# EAGLE design Mega8 (EAGLE 5.11)
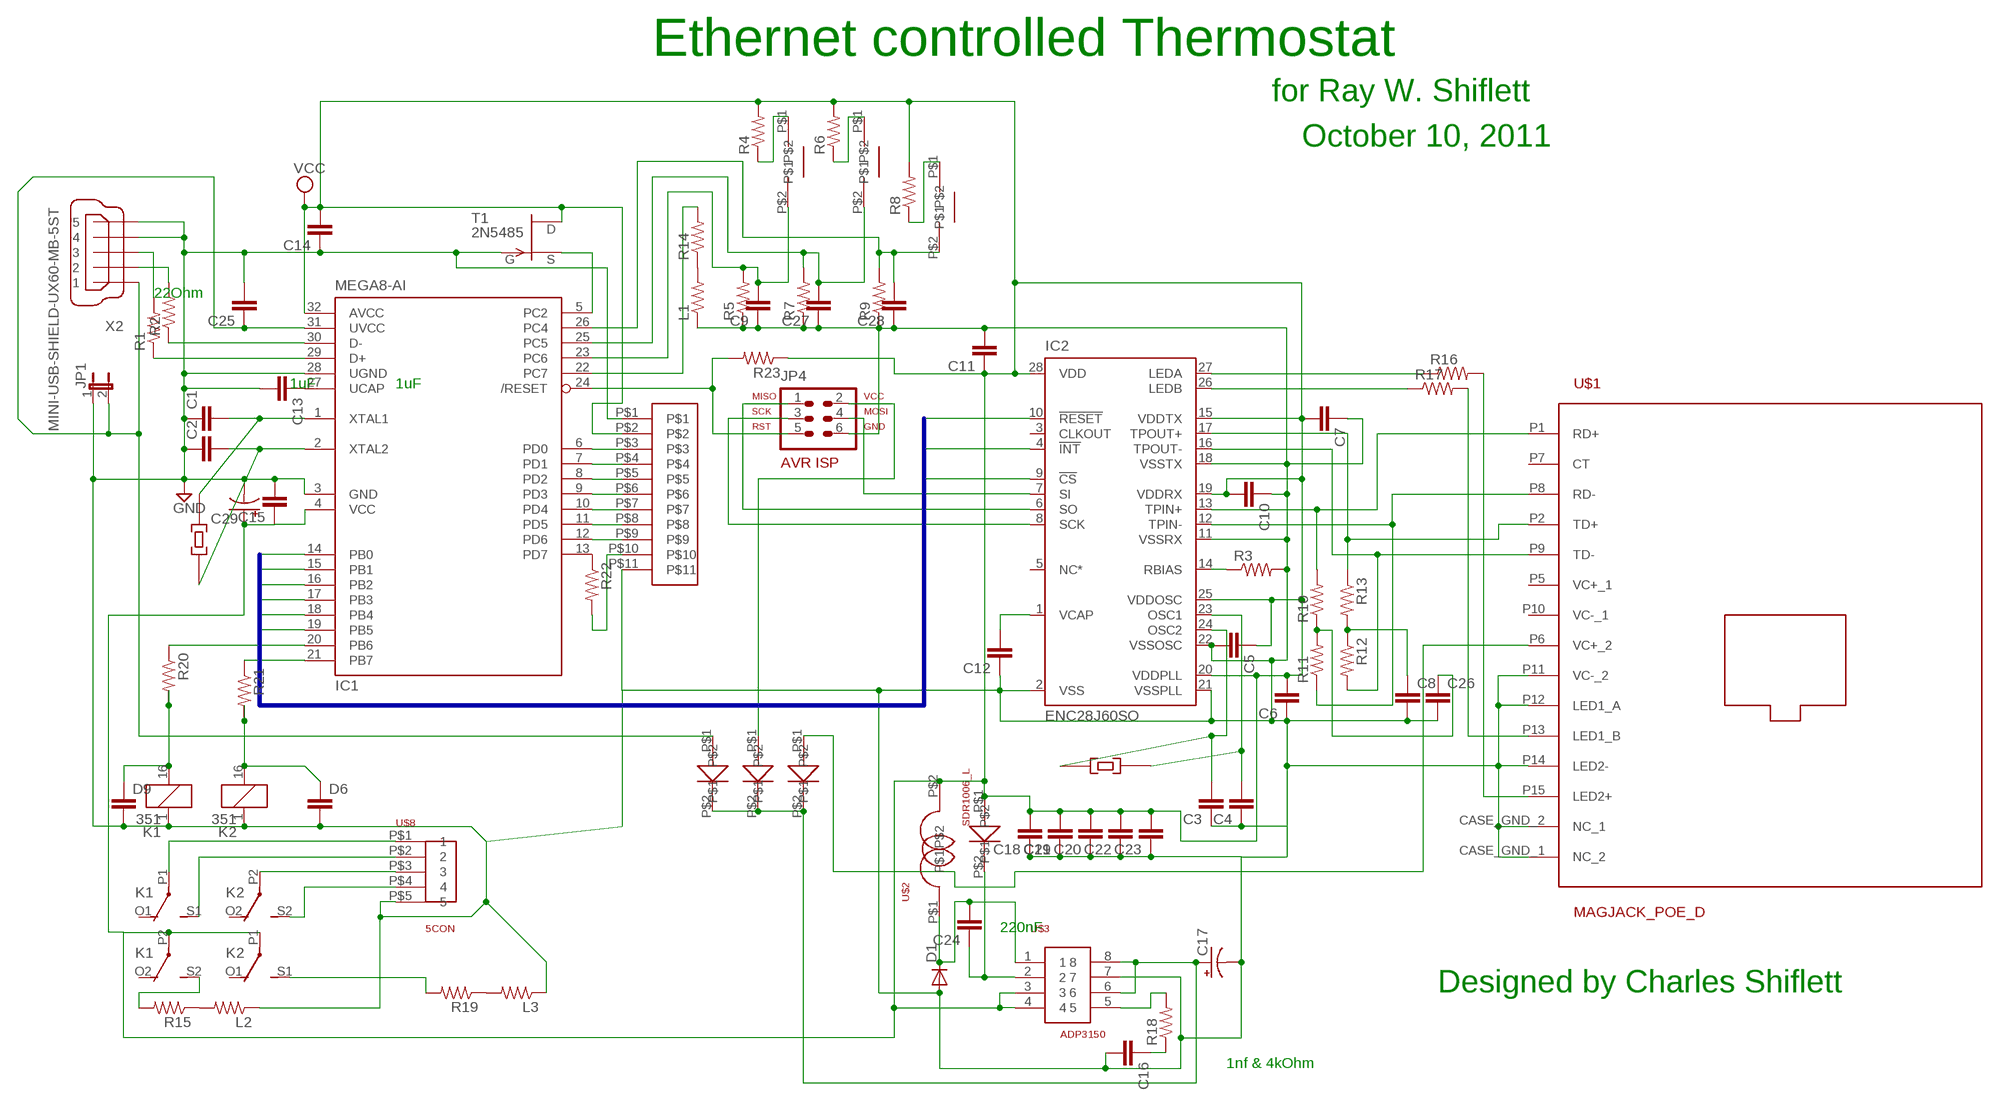
[diagram p0: schematic, sheet 1]

## Parts
C1  C-EUC0805  [C0805]
C2  C-EUC0805  [C0805]
C3  C-EUC0805  [C0805]
C4  C-EUC0805  [C0805]
C5  C-EUC0805  [C0805]
C6  C-EUC0805  [C0805]
C7  C-EUC0805  [C0805]
C8  C-EUC0805  [C0805]
C9  C-EUC0805  [C0805]
C10  C-EUC0805  [C0805]
C11  C-EUC0805  [C0805]
C12  C-EUC0805  [C0805]
C13  C-EUC0805  [C0805]
C14  C-EUC0805  [C0805]
C15  C-EUC0805  [C0805]
C16  C-EUC0805  [C0805]
C17  CPOL-USF  [PANASONIC_F]
C18  C-EUC0805  [C0805]
C19  C-EUC0805  [C0805]
C20  C-EUC0805  [C0805]
C21  C-EUC0805  [C0805]
C22  C-EUC0805  [C0805]
C23  C-EUC0805  [C0805]
C24  C-EUC0805  [C0805]
C25  C-EUC0805  [C0805]
C26  C-EUC0805  [C0805]
C27  C-EUC0805  [C0805]
C28  C-EUC0805  [C0805]
C29  CPOL-USD  [PANASONIC_D]
D1  DIODE-SMB  [SMB]
D6  C-EUC0603  [C0603]
D9  C-EUC0603  [C0603]
IC1  MEGA8-AI  [TQFP32-08]
IC2  ENC28J60SO  [SO28W]
JP1  JP1E  [JP1]
JP4  AVR-ISP-6VERT  [AVR-ISP-6]
K1  351  [351]
K2  351  [351]
L1  R-US_M0805  [M0805]
L2  R-US_M0805  [M0805]
L3  R-US_M0805  [M0805]
R1  R-US_M0805  [M0805]
R2  R-US_M0805  [M0805]
R3  R-US_M0805  [M0805]
R4  R-US_M0805  [M0805]
R5  R-US_M0805  [M0805]
R6  R-US_M0805  [M0805]
R7  R-US_M0805  [M0805]
R8  R-US_M0805  [M0805]
R9  R-US_M0805  [M0805]
R10  R-US_M0805  [M0805]
R11  R-US_M0805  [M0805]
R12  R-US_M0805  [M0805]
R13  R-US_M0805  [M0805]
R14  R-US_M0805  [M0805]
R15  R-US_M0805  [M0805]
R16  R-US_M0805  [M0805]
R17  R-US_M0805  [M0805]
R18  R-US_M0805  [M0805]
R19  R-US_M0805  [M0805]
R20  R-US_M0805  [M0805]
R21  R-US_M0805  [M0805]
R22  R-US_M0805  [M0805]
R23  R-US_M0805  [M0805]
T1  2N5485  [TO92-]
U$1  MAGJACK_POE_D  [ETH_FOOT_PRNT]
U$2  SDR1006_L  [SDR1006_FOOT]
U$3  ADP3150  [SOIC8]
U$4  IN4148  [SOD523F]
U$5  IN4148  [SOD523F]
U$6  IN4148  [SOD523F]
U$7  IN4148  [SOD523F]
U$8  5CON  [5CON]
U$9  SWITCH  [SWITCH]
U$10  SWITCH  [SWITCH]
U$11  SWITCH  [SWITCH]
U$12  LCDCONN  [LCDCONN]
U$13  HC49US  [HC49US]
U$14  HC49US  [HC49US]
X2  MINI-USB-SHIELD-UX60-MB-5ST  [UX60-MB-5ST]

## Nets
B0: IC1.14(PB0) IC2.9(!CS)
B1: IC1.15(PB1) IC2.8(SCK) JP4.3
B2: IC1.16(PB2) IC2.7(SI) JP4.4
B3: IC1.17(PB3) IC2.6(SO) JP4.1
B4: IC1.18(PB4) IC2.10(!RESET)
B5: IC1.19(PB5) IC2.4(!INT)
GND: C1.1 C2.1 C3.1 C4.1 C5.2 C6.1 C7.1 C8.2 C9.1 C10.1 C11.2 C12.1 C13.2 C14.1 C15.2 C16.2 C17.- C18.1 C19.1 C20.1 C21.1 C22.1 C23.1 C25.2 C26.2 C27.1 C28.1 C29.- D1.A D6.2 D9.2 IC1.3(GND) IC1.28(UGND) IC2.2(VSS) IC2.11(VSSRX) IC2.18(VSSTX) IC2.21(VSSPLL) IC2.22(VSSOSC) JP1.1 JP4.6 K1.1 K2.1 L1.1 L2.1 L3.1 R3.2 R5.1 R7.1 R9.1 T1.1(G) U$1.CASE_GND_1(NC_2) U$1.CASE_GND_2(NC_1) U$1.P11(VC-_2) U$1.P12(LED1_A) U$1.P14(LED2-) U$3.7 U$8.P$5 U$12.P$1 U$12.P$11 X2.4 X2.5
N$2: L2.2 R15.1
N$3: L1.2 R14.1
N$4: IC1.30(D-) R2.1
N$5: IC1.29(D+) R1.1
N$6: R2.2 X2.2
N$7: R1.2 X2.3
N$9: K1.S2(3:S) R15.2
N$10: C1.2 IC1.1(XTAL1) U$13.P$2
N$11: C2.2 IC1.2(XTAL2) U$13.P$1
N$12: C12.2 IC2.1(VCAP)
N$14: U$1.P6(VC+_2) U$6.P$1
N$15: IC1.22(PC7) R14.2
N$16: R4.1 U$9.P$1
N$18: IC2.14(RBIAS) R3.1
N$19: IC2.12(TPIN-) R11.1 U$1.P8(RD-)
N$20: IC2.13(TPIN+) R10.2 U$1.P1(RD+)
N$21: IC2.17(TPOUT+) R13.1 U$1.P2(TD+)
N$22: IC2.16(TPOUT-) R12.2 U$1.P9(TD-)
N$23: C8.1 R12.1 R13.2
N$24: C26.1 R10.1 R11.2
N$25: C13.1 IC1.27(UCAP)
N$26: R17.2 U$1.P13(LED1_B)
N$27: C9.2 IC1.23(PC6) R5.2 U$9.P$2
N$28: R6.1 U$10.P$1
N$29: C27.2 IC1.25(PC5) R7.2 U$10.P$2
N$30: C4.2 IC2.23(OSC1) U$14.P$1
N$31: C3.2 IC2.24(OSC2) U$14.P$2
N$32: IC2.27(LEDA) R16.1
N$33: IC2.26(LEDB) R17.1
N$34: R16.2 U$1.P15(LED2+)
N$35: R8.1 U$11.P$1
N$36: IC1.5(PC2) T1.2(S)
N$37: IC1.20(PB6) R20.1
N$38: IC1.6(PD0) U$12.P$3
N$39: IC1.7(PD1) U$12.P$4
N$40: IC1.8(PD2) U$12.P$5
N$41: IC1.9(PD3) U$12.P$6
N$42: IC1.10(PD4) U$12.P$7
N$43: IC1.11(PD5) U$12.P$8
N$44: IC1.12(PD6) U$12.P$9
N$45: IC1.13(PD7) R22.1
N$46: IC1.24(/RESET) JP4.5 R23.2
N$47: IC1.21(PB7) R21.1
N$48: C28.2 IC1.26(PC4) R9.2 U$11.P$2
N$49: C16.1 R18.1
N$50: R18.2 U$3.5
N$51: C17.+ U$3.6 U$3.8 U$4.P$2 U$5.P$2 U$6.P$2
N$52: JP4.2 U$5.P$1
N$53: K1.P1(2:P) U$8.P$1
N$54: C24.1 U$3.2 U$7.P$2
N$55: R22.2 U$12.P$10
N$56: C24.2 D1.C U$2.P$1 U$3.1
N$57: C25.1 IC1.31(UVCC) JP1.2 U$4.P$1 X2.1
N$58: K1.S1(2:S) U$8.P$2
N$59: K2.P2(3:P) U$8.P$3
N$60: K2.S2(3:S) U$8.P$4
N$61: L3.2 R19.1
N$62: K2.S1(2:S) R19.2
N$65: D6.1 K2.16 R21.2
N$66: D9.1 K1.16 R20.2
VCC: C5.1 C6.2 C7.2 C10.2 C11.1 C14.2 C15.1 C18.2 C19.2 C20.2 C21.2 C22.2 C23.2 C29.+ IC1.4(VCC) IC1.32(AVCC) IC2.15(VDDTX) IC2.19(VDDRX) IC2.20(VDDPLL) IC2.25(VDDOSC) IC2.28(VDD) K1.P2(3:P) K2.P1(2:P) R4.2 R6.2 R8.2 R23.1 T1.3(D) U$2.P$2 U$3.3 U$3.4 U$7.P$1 U$12.P$2
Unconnected: IC2.3(CLKOUT) IC2.5(NC*) K1.O1(2:O) K1.O2(3:O) K2.O1(2:O) K2.O2(3:O) U$1.P7(CT) X2.M1(S1) X2.M2(S2) X2.M3(S3) X2.M4(S4)

## Buses
B[0..5]

## Notes on the sheet
- Ethernet controlled Thermostat
- for Ray W. Shiflett
- October 10, 2011
- 22Ohm
- 1uF | 1uF
- 220nF
- Designed by Charles Shiflett
- 1nf & 4kOhm

## Power pins joined to a net without a drawn wire
VC+_1: U$1.P5(VC+_1)
VC-_1: U$1.P10(VC-_1)

## Library data of the parts
C1-C16 C18-C28 D6 D9 = resistor:C-EU: CAPACITOR, European symbol
C17 C29 = resistor:CPOL-US: POLARIZED CAPACITOR, American symbol
D1 = diode:DIODE-: DIODE
IC1 = atmel:MEGA8: MICROCONTROLLER 8 Kbytes FLASH, 1 kbytes SRAM, 512 bytes EEPROM, USART, 6-channel 10 bit ADC, 2-channel 8 bit ADC Pin compatible with Atmega48, ATMega88, ATMega168 Source: avr.lbr; MPN: ATMEGA8-16AU; OC_FARNELL: 9171371; OC_NEWARK: 73M8863
IC2 = microchip-6:ENC28J60: Stand-Alone Ethernet Controller with SPI Interface Source: http://ww1.microchip.com/downloads/en/DeviceDoc/39662c.pdf
JP1 = jumper:JP1E: JUMPER
JP4 = avr-7:AVR-ISP-6: AVR ISP-6 Serial Programming Header
K1 K2 = relay:351: RELAY 2 x switch, Omron; OC_FARNELL: unknown; OC_NEWARK: unknown
L1-L3 R1-R23 = resistor:R-US_: RESISTOR, American symbol
T1 = transistor-fet:?548*: N-Channel JFETs Source: VISHAY 2N5484.pdf Compatible: TO92 2N5245 J304 J305 U310 J308 J309 J310 TO72 2N4416 2N4416A 2N3823 2N4351 3N169 3N170 3N171 MFE3002 TO18 2N3796 2N3797 MFE825 Source: Motorola European Master Guide Pacge 3-59
U$1 = bear:MAGJACK_POE_D
U$2 = bear:SDR1006_L
U$3 = bear:ADP3150
U$4-U$7 = bear:IN4148
U$8 = bear:5CON: TERM BLOCK RCPT 5POS VERT 282837-5
U$9-U$11 = bear:SWITCH
U$12 = bear:LCDCONN
U$13 U$14 = bear:HC49US
X2 = con-hirose:MINI-USB-SHIELD-: MINI USB Connector Source: http://www.hirose.co.jp/cataloge_hp/e24000019.pdf; OC_FARNELL: unknown; OC_NEWARK: unknown

## Board
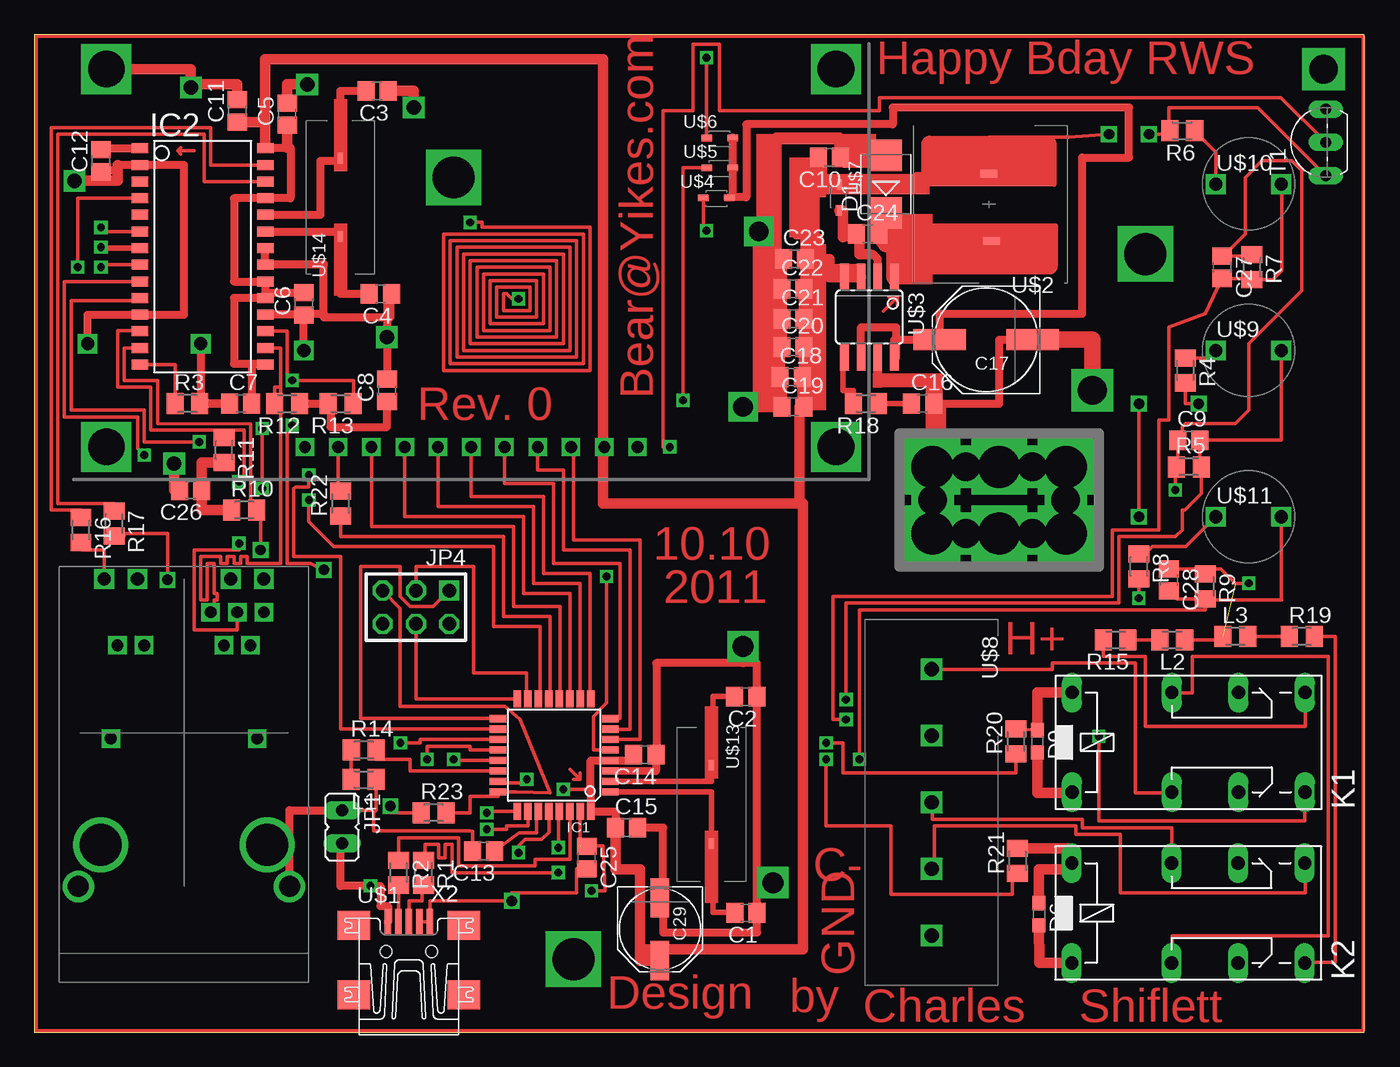
[diagram p1: board, top side]
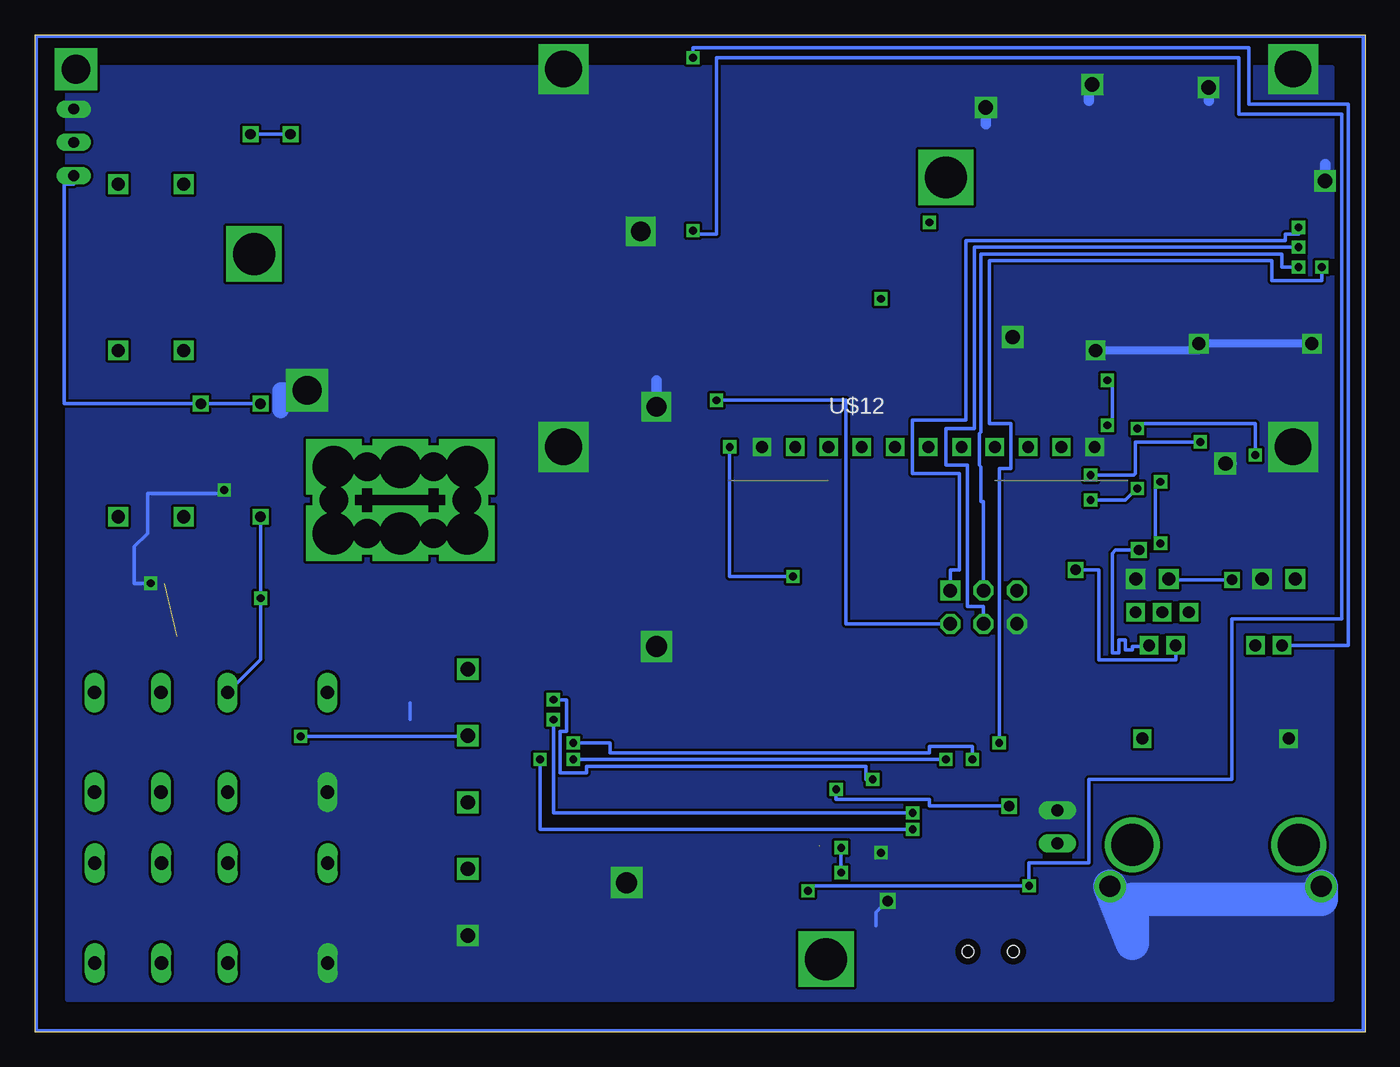
[diagram p2: board, bottom side, seen from below]

Size 101.52 x 76.19 mm. Coordinates in mm from the lower left corner, seen from the top.
Outline: 0,0 101.52,0 101.52,76.19 0,76.19 0,0
Copper layers (1*16): Top 0.035mm / dielectric 1.5mm / Bottom 0.035mm
Design rules "default *": minimum track width 8mil, minimum drill 24mil, track to track 8mil, track to pad 8mil, pad to pad 8mil, via to via 8mil, smd to smd 8mil, copper to edge 20mil, drill to drill 10mil, minimum pad ring 10mil, minimum via ring 8mil, stop-mask expansion 4mil, vias tented up to drill 0mil, thermal gap 10mil

### Footprints (pad centres in the part's own frame; a part is rotated, then mirrored left to right if it is on the bottom)
C0805 = smd 1.3 x 1.5: 1 -0.85,0; 2 0.85,0
PANASONIC_F = smd 4 x 1.6: + 3.55,0; - -3.55,0
PANASONIC_D = smd 3 x 1.4: + 2.4,0; - -2.4,0
SMB = smd 2.4 x 2.4: A 2.2,0; C -2.2,0
C0603 = smd 1.1 x 1: 1 -0.85,0; 2 0.85,0
TQFP32-08 = smd 1.27 x 0.559: 1 -4.293,2.8; 2 -4.293,2; 3 -4.293,1.2; 4 -4.293,0.4; 5 -4.293,-0.4; 6 -4.293,-1.2; 7 -4.293,-2; 8 -4.293,-2.8; 17 4.293,-2.8; 18 4.293,-2; 19 4.293,-1.2; 20 4.293,-0.4; 21 4.293,0.4; 22 4.293,1.2; 23 4.293,2; 24 4.293,2.8 | smd 0.559 x 1.27: 9 -2.8,-4.293; 10 -2,-4.293; 11 -1.2,-4.293; 12 -0.4,-4.293; 13 0.4,-4.293; 14 1.2,-4.293; 15 2,-4.293; 16 2.8,-4.293; 25 2.8,4.293; 26 2,4.293; 27 1.2,4.293; 28 0.4,4.293; 29 -0.4,4.293; 30 -1.2,4.293; 31 -2,4.293; 32 -2.8,4.293
SO28W = smd 0.762 x 1.27: 1 -7.62,-4.78; 2 -6.35,-4.78; 3 -5.08,-4.78; 4 -3.81,-4.78; 5 -2.54,-4.78; 6 -1.27,-4.78; 7 0,-4.78; 8 1.27,-4.78; 9 2.54,-4.78; 10 3.81,-4.78; 11 5.08,-4.78; 12 6.35,-4.78; 13 7.62,-4.78; 14 8.89,-4.78; 15 8.89,4.78; 16 7.62,4.78; 17 6.35,4.78; 18 5.08,4.78; 19 3.81,4.78; 20 2.54,4.78; 21 1.27,4.78; 22 0,4.78; 23 -1.27,4.78; 24 -2.54,4.78; 25 -3.81,4.78; 26 -5.08,4.78; 27 -6.35,4.78; 28 -7.62,4.78
JP1 = drill 0.914 long: 1 0,-1.27; 2 0,1.27
AVR-ISP-6 = drill 1.016 square: 1 -2.54,-1.27 | drill 1.016 octagon: 2 -2.54,1.27; 3 0,-1.27; 4 0,1.27; 5 2.54,-1.27; 6 2.54,1.27
351 = drill 1.016 long: 1 -3.81,-3.81; 16 -3.81,3.81; O1 8.89,-3.81; O2 8.89,3.81; P1 3.81,-3.81; P2 3.81,3.81; S1 13.97,-3.81; S2 13.97,3.81
M0805 = smd 1.3 x 1.6: 1 -0.95,0; 2 0.95,0
TO92- = drill 0.813 long: 1 2.54,0; 2 0,0; 3 -2.54,0
ETH_FOOT_PRNT = drill 1.6 round: CASE_GND_1 -8.065,11.748; CASE_GND_2 8.065,11.748 | drill 0.9 square: P1 -5.08,-6.668; P2 -3.048,-6.668; P5 3.048,-6.668; P6 5.08,-6.668; P7 -6.096,-9.207; P8 -4.064,-9.207; P9 -2.032,-9.207; P10 -5.588,0.445; P11 5.588,0.445 | drill 1 square: P12 -6.096,-11.748; P13 -3.556,-11.748; P14 3.556,-11.748; P15 6.096,-11.748 | drill 3.2 round: PLASTIC_1 -6.35,8.572; PLASTIC_2 6.35,8.572
SDR1006_FOOT = smd 1.27 x 0.635: P$1 -0.2,2.8; P$2 0,-2.35
SOIC8 = smd 0.66 x 2.032: 1 -1.905,-3.073; 2 -0.635,-3.073; 3 0.635,-3.073; 4 1.905,-3.073; 5 1.905,3.073; 6 0.635,3.073; 7 -0.635,3.073; 8 -1.905,3.073
SOD523F = smd 0.813 x 0.406: P$1 -1,0; P$2 1,0
5CON = drill 1.1 square: P$1 -10.16,0; P$2 -5.08,0; P$3 0,0; P$4 5.08,0; P$5 10.16,0
SWITCH = drill 1 square: P$1 -2.5,0; P$2 2.5,0
LCDCONN = drill 0.9 square: P$1 -12.7,0; P$2 -10.16,0; P$3 -7.62,0; P$4 -5.08,0; P$5 -2.54,0; P$6 0,0; P$7 2.54,0; P$8 5.08,0; P$9 7.62,0; P$10 10.16,0; P$11 12.7,0
HC49US = smd 0.813 x 0.406: P$1 -3,0; P$2 3,0
UX60-MB-5ST = smd 2 x 0.5: 1 2.25,1.6; 2 2.25,0.8; 3 2.25,0; 4 2.25,-0.8; 5 2.25,-1.6 | smd 2.2 x 2.5: M1 -3.3,-4.2; M2 -3.3,4.2; M3 2,4.2; M4 2,-4.2 | hole 0.9: 0,-1.75; 0,1.75

### Placement (x,y rotation side)
C1  54.33,9.12 180 top
C2  54.31,25.63 180 top
C3  26.16,71.88 180 top
C4  26.42,56.39 180 top
C5  19.3,70.1 90 top
C6  20.57,55.63 90 top
C7  15.75,48.01 0 top
C8  26.92,49.02 90 top
C9  88.14,45.21 0 top
C10  60.71,66.8 180 top
C11  15.49,70.36 90 top
C12  5.08,66.55 90 top
C13  34.29,13.84 180 top
C14  46.61,21.21 180 top
C15  45.21,15.62 0 top
C16  67.82,48.01 0 top
C17  72.67,52.88 180 top
C18  57.78,50.04 0 top
C19  57.91,47.75 0 top
C20  57.91,52.32 0 top
C21  57.91,54.48 0 top
C22  57.91,56.77 0 top
C23  58.04,59.05 0 top
C24  63.63,60.96 0 top
C25  42.16,13.34 270 top
C26  11.94,41.4 180 top
C27  90.68,58.42 270 top
C28  86.61,34.54 270 top
C29  47.76,7.87 270 top
D1  65.02,64.77 90 top
D6  76.71,9.02 270 top
D9  76.58,22.23 270 top
IC1  39.68,21.16 180 top
IC2  12.85,59.88 270 top
JP1  23.49,15.68 180 top
JP4  29.13,32.46 180 top
K1  83.04,22.14 0 top
K2  83.02,9.11 0 top
L1  25.15,19.3 180 top
L2  86.87,29.97 180 top
L3  91.69,30.23 0 top
R1  29.72,12.19 270 top
R2  27.81,12.19 270 top
R3  11.68,48.01 0 top
R4  87.88,50.55 270 top
R5  88.14,43.18 0 top
R6  87.63,68.83 180 top
R7  92.96,58.42 270 top
R8  84.33,35.56 270 top
R9  89.41,34.04 270 top
R10  16,39.88 0 top
R11  14.48,44.45 270 top
R12  19.3,48.01 180 top
R13  23.37,48.01 180 top
R14  25.15,21.56 0 top
R15  82.55,29.97 180 top
R16  3.56,38.35 270 top
R17  6.1,38.86 270 top
R18  63.5,48.01 180 top
R19  96.77,30.23 0 top
R20  74.93,22.23 90 top
R21  75.06,13.08 90 top
R22  23.37,40.39 90 top
R23  30.48,16.76 0 top
T1  98.59,67.96 90 top
U$1  11.42,22.88 180 top
U$2  72.87,63.22 180 top
U$3  63.75,54.61 180 top
U$4  52.07,63.75 0 top
U$5  52.32,66.04 0 top
U$6  52.32,68.33 0 top
U$7  61.47,63.75 270 top
U$8  68.5,17.56 270 top
U$9  92.71,52.07 0 top
U$10  92.71,64.77 0 top
U$11  92.71,39.37 0 top
U$12  33.35,44.69 0 bottom
U$13  51.69,17.4 270 top
U$14  23.37,63.75 90 top
X2  28.59,6.17 90 top

### Tracks (layer width: path | path; a pad name or v marks a point on that pad's centre or on a via)
B0  (via drill 0.6)
  Top 0.254: IC1.14 38.61,25.45 38.61,30.99 35.05,30.99 35.05,37.08 22.86,37.08 20.95,38.99 v20.95,40.64 | IC2.9 2.29,57.34 2.29,46.99 7.87,46.99 7.87,44.58 v8.38,44.07 | v17.4,46.1 v17.4,41.53
  Bottom 0.254: v8.38,44.07 8.38,46.48 17.02,46.48 v17.4,46.1 | v17.4,41.53 18.29,40.64 v20.95,40.64
B1  (via drill 0.6)
  Top 0.254: IC1.15 37.59,25.45 37.59,27.43 33.53,27.43 33.53,35.56 29.13,35.56 JP4.3 | IC2.8 5.08,58.61 v5.08,58.42
  Bottom 0.254: JP4.3 29.13,40.51 29.34,40.51 29.34,43.18 29.46,43.31 29.46,45.72 29.34,45.85 29.34,59.44 6.35,59.44 6.35,58.42 v5.08,58.42
B2  (via drill 0.6)
  Top 0.254: IC1.16 29.13,25.45 JP4.4
  Top 0.406: IC2.7 5.08,59.88 v5.08,59.94
  Bottom 0.254: v5.08,59.94 29.84,59.94 29.84,46.1 32,46.1 32,43.31 30.35,43.31 30.35,32.51 29.13,32.51 JP4.4
B3  (via drill 0.6)
  Top 0.254: IC1.17 24.89,23.96 24.89,35.56 27.94,35.56 27.94,33.27 28.7,32.51 30.45,32.51 JP4.1 | IC2.6 5.08,61.15 v5.08,61.47
  Bottom 0.254: 31.67,34.67 JP4.1 31.67,35.31 30.99,35.31 30.99,42.67 34.54,42.67 34.54,46.74 30.48,46.74 30.48,60.45 6.1,60.45 6.1,60.96 5.08,60.96 v5.08,61.47
B4  (via drill 0.6)
  Top 0.254: IC1.18 23.37,23.16 23.37,36.32 19.81,36.32 19.81,41.53 19.94,41.66 20.95,41.66 v20.95,42.55 | IC2.10 8.07,55.88 2.79,55.88 2.79,47.5 8.38,47.5 8.38,45.09 v12.57,45.09
  Bottom 0.254: v12.57,45.09 17.53,45.09 17.53,42.67 17.65,42.55 v20.95,42.55
B5  (via drill 0.6)
  Top 0.254: IC2.4 3.3,63.69 v3.3,58.42 | v27.94,22.1 29.46,22.1 29.46,22.36 IC1.19
  Bottom 0.254: v27.94,22.1 27.94,43.05 27.05,43.05 27.05,46.48 28.7,46.48 28.7,58.93 7.11,58.93 7.11,57.4 3.3,57.4 v3.3,58.42
GND  (via drill 0.6, 0.8, 1, 1.1, 1.5, 1.6, 2.2, 2.8)  (1 unrouted)
  Top 0.254: L2.1 90.74,29.97 L3.1 | R9.1 89,35.39 C28.1 90.59,35.39 91.69,34.29 v92.71,34.29 | v87.12,41.4 87.12,43.11 R5.1 87.29,43.18 C9.1 87.63,45.55 87.63,46.23 87.88,46.48 91.69,46.48 92.71,47.5 92.71,52.58 96.77,56.64 96.77,65.79 96.01,66.55 93.73,66.55 92.46,65.28 92.46,60.96 90.77,59.27 C27.1 92.86,59.27 R7.1 | X2.4 X2.5 30.23,8.42 30.23,10.03 v36.45,10.03 36.45,10.67 41.4,10.67 41.4,12.48 C25.2 | 54.1,28.19 v54.1,29.46 | JP1.1 26.1,16.95 | 26.1,16.95 L1.1 | C13.2 33.44,15.33 33.27,15.37 25.91,15.37 25.91,16.76 26.1,16.95 | IC1.28 39.28,15.28 38.73,14.73 37.47,14.73 36.96,14.22 v36.96,13.72
  Top 0.406: 47.46,19.96 IC1.3
  Top 0.61: 47.46,19.96 C14.1 47.5,21.21 47.5,28.19 54.1,28.19 55.16,28.19 C2.1 55.18,25.63 C1.1 55.18,7.62 48.01,7.62 48.01,10.92 48.01,15.62 C15.2 | R3.2 C7.1 12.7,48.01 v12.7,52.58 | v4.06,52.58 4.06,54.8 IC2.11 11.43,54.8 11.43,66.23 IC2.2 6.35,66.23 6.35,65.79 5.08,65.79 C12.1 | v20.57,52.07 C6.1 20.57,54.8 | 20.57,54.8 IC2.18 | 20.57,54.8 20.83,54.8 20.83,54.86 22.1,54.86 | 22.1,54.86 22.1,58.61 | 22.1,58.61 IC2.21 IC2.22 | 22.1,58.61 22.1,58.67 | 22.1,54.86 22.1,54.61 27.18,54.61 27.18,56.39 C4.1 26.92,56.39 v26.92,53.09 C8.2 | U$3.7 64.41,51.54 64.41,49.53 68.83,49.53 68.83,48.01 C16.2 69.14,48.01 73.66,48.01 73.66,52.88 C17.- | JP1.1 19.48,16.95 U$1.CASE_GND_1
  Top 0.813: U$8.P$5 68.5,7.37 | C10.1 65.02,66.8 D1.A 61.47,66.97 61.47,68.33 56.64,68.33 56.64,59.18 57.19,59.18 C23.1 57.06,59.05 C22.1 C21.1 C20.1 56.94,52.32 C18.1 57.06,50.04 C19.1 v54.1,47.75 | 6.35,66.23 6.35,65.02 v3.05,65.02 | C11.2 15.49,72.39 11.94,72.39 v11.94,72.14 11.94,73.55 v5.5,73.55 | C5.2 19.3,72.39 v20.83,72.39 | C3.1 28.96,71.88 v28.96,70.61 | C26.2 10.67,41.4 v10.67,43.43 | 69.14,45.16 69.14,48.01 | C29.- 48.01,10.02 48.01,10.92 | D9.2 76.58,18.29 79.23,18.29 K1.1 | D6.2 76.72,5.3 K2.1
  Top 1.27: C17.- 80.77,52.88 v80.77,49.02
  Bottom 0.254: v92.71,34.29 93.98,34.29 93.98,37.08 92.96,38.1 92.96,41.15 87.38,41.15 v87.12,41.4 | 72.9,25.15 72.9,23.88 | v36.45,10.03 37.34,9.14 37.34,8.13 | v36.96,13.72 37.08,13.72 37.21,13.59
  Bottom 0.61: v4.06,52.58 v12.7,52.58 12.7,52.07 v20.57,52.07
  Bottom 0.813: v3.05,65.02 3.05,66.29 | v11.94,72.14 11.94,71.12 | v20.83,72.39 21.08,72.39 21.08,71.12 | v28.96,70.61 28.96,69.34 | v10.67,43.43 10.16,43.43 | v54.1,47.75 54.1,49.78
  Bottom 1.27: v80.77,49.02 82.8,49.02 82.8,47.5
  Bottom 2.54: U$1.CASE_GND_1 17.78,6.81 17.78,10.16 3.36,10.16 U$1.CASE_GND_2
  other vias: 61.2,73.55 61.2,44.7 5.5,44.7 55.3,61.15 56.39,11.43
  pour Bottom (no thermals): 2.54,73.66 99.06,73.66 99.06,2.54 2.54,2.54
N$1
  Top 0.254: 65.89,56.13 64.82,55.07 | 65.89,56.13 65.23,56.13 | 65.89,55.52 65.89,56.13
N$2
  Top 0.254: R15.1 L2.2
N$3
  Top 0.254: R14.1 L1.2
N$4
  Top 0.254: IC1.30 40.89,16.87 40.89,13.21 38.23,13.21 38.23,12.7 32.38,12.7 32.38,14.86 27.81,14.86 R2.1
N$5  (via drill 0.6)
  Top 0.254: 40.13,16.87 IC1.29 40.01,16.87 v40.01,14.1 | v40.01,12.19 31.88,12.19 31.88,14.35 31.37,14.35 31.37,13.34 30.86,13.34 30.86,14.35 29.84,14.35 29.84,13.72 29.72,13.72 R1.1
  Bottom 0.254: v40.01,12.19 v40.01,14.1
N$6
  Top 0.254: R2.2 27.79,11.24 X2.2
N$7
  Top 0.254: R1.2 29.59,11.24 29.59,10.03 28.59,10.03 X2.3
N$8  (via drill 3.2)
  other vias: 41.15,5.59
N$9
  Top 0.254: K1.S2 97.03,25.95 97.03,23.37 84.84,23.37 84.84,28.7 81.6,28.7 R15.2
N$10
  Top 0.406: IC1.1 51.69,18.36 U$13.P$2 51.82,14.4 51.82,9.14 53.48,9.14 C1.2
N$11
  Top 0.406: IC1.2 51.69,19.16 U$13.P$1 51.82,20.4 51.82,25.65 53.45,25.65 C2.2
N$12
  Top 0.61: IC2.1 5.08,67.5 C12.2
N$13  (via drill 2.2)
  other vias: 98.42,73.53
N$14  (via drill 0.6)
  Top 0.254: v51.31,74.42 51.32,74.42 U$6.P$1
  Bottom 0.254: U$1.P6 1.27,29.55 1.27,70.87 8.89,70.87 8.89,75.18 51.31,75.18 v51.31,74.42
N$15
  Top 0.254: IC1.22 28.7,19.96 28.7,20.83 26.1,20.83 R14.2
N$16
  Top 0.254: R4.1 89.64,51.5 U$9.P$1
N$17  (via drill 3.2)
  other vias: 84.84,59.44
N$18
  Top 0.254: IC2.14 10.73,50.99 R3.1
N$19  (via drill 0.6)
  Top 0.254: 14.48,45.97 16,45.97 16,42.29 v15.62,42.04 | 14.48,45.97 8.89,45.97 8.89,49.28 6.35,49.28 6.35,53.59 8.07,53.59 IC2.12 | 14.48,45.97 R11.1 | U$1.P8 15.48,30.73 12.19,30.73 12.19,36.83 15.62,36.83 v15.62,37.34
  Bottom 0.254: v15.62,42.04 16,42.29 16,37.34 v15.62,37.34
N$20  (via drill 0.8)
  Top 0.254: IC2.13 6.86,52.26 6.86,49.78 9.4,49.78 9.4,46.48 16.52,46.46 16.52,39.88 | 16.52,39.88 R10.2 17.27,39.62 v17.27,36.83 | 16.52,39.88 16.51,39.88
  Bottom 0.254: v17.27,36.83 19.05,36.83 19.3,36.58 19.3,28.96 18.8,28.96 18.8,29.97 18.29,29.97 18.29,29.21 17.78,29.21 17.78,29.46 16.58,29.46 U$1.P1
N$21  (via drill 0.6, 0.8)
  Top 0.254: IC2.17 19.3,53.53 19.3,49.78 v19.68,49.78 24.38,49.78 24.38,48.01 R13.1 | v22.1,35.31 21.08,35.81 19.3,35.81 19.3,46.35 v19.68,46.35
  Bottom 0.254: v22.1,35.31 20.32,35.31 20.32,28.45 14.47,28.45 U$1.P2 | v19.68,49.78 19.3,49.78 19.3,46.35 v19.68,46.35
N$22
  Top 0.254: IC2.16 18.8,52.26 18.8,49.28 | 18.8,49.28 18.35,49.28 R12.2 | 18.8,49.28 18.8,35.81 16.26,35.81 16.26,36.32 15.75,36.32 15.75,35.81 15.24,35.81 15.24,36.32 14.73,36.32 14.73,35.81 14.22,35.81 14.22,36.32 12.7,36.32 12.7,33.02 13.21,33.02 13.21,35.81 13.72,35.81 13.72,33.53 13.97,33.53 13.97,33.02 13.72,33.02 13.72,32.35 U$1.P9
N$23
  Top 0.61: R12.1 R13.2 22.61,48.01 22.61,46.23 26.92,46.23 C8.1
N$24
  Top 0.406: R10.1 14.48,39.88
  Top 0.813: R11.2 12.79,43.5 C26.1 12.77,39.88 R10.1
N$25
  Top 0.254: IC1.27 38.35,16.87 38.35,15.24 37,15.24 C13.1
N$26  (via drill 0.8)
  Top 0.254: R17.2 6.86,37.91 6.86,38.1 10.16,38.1 v10.16,34.54
  Bottom 0.254: v10.16,34.54 14.89,34.54 U$1.P13
N$27  (via drill 0.6)
  Top 0.254: v61.98,25.4 61.98,32.77 82.8,32.77 82.8,37.85 87.12,37.85 87.63,38.35 87.63,39.88 87.82,39.88 89.09,41.15 R5.2 88.99,43.18 C9.2 95.21,45.21 U$9.P$2 | v37.59,19.3 37.59,19.05 35.39,19.05 IC1.23
  Bottom 0.254: v61.98,25.4 60.96,25.4 60.96,22.99 61.47,22.99 61.47,19.81 59.44,19.81 59.44,20.32 38.1,20.32 38.1,19.3 v37.59,19.3
N$28
  Top 0.254: U$10.P$1 90.21,67.2 R6.1
N$29  (via drill 0.6)
  Top 0.254: IC1.25 34.54,16.87 v34.54,16.76 | v61.98,23.88 60.96,23.88 60.96,33.27 82.3,33.27 82.3,38.35 85.85,38.35 85.85,46.74 86.61,46.74 86.61,53.85 89.41,54.86 C27.2 92.86,57.57 R7.2 94.55,57.47 95.25,58.17 95.25,64.73 U$10.P$2
  Bottom 0.254: v34.54,16.76 61.98,16.76 v61.98,23.88
N$30
  Top 0.61: IC2.23 23.37,61.15 U$14.P$1 23.37,56.39 C4.2
N$31
  Top 0.61: IC2.24 21.84,62.42 21.84,66.55 23.37,66.55 U$14.P$2 23.37,71.88 C3.2
N$32
  Top 0.254: IC2.27 13.46,66.23 13.46,69.09 1.27,69.09 1.27,39.88 3.56,39.88 R16.1 3.56,39.12
N$33
  Top 0.254: IC2.26 12.95,64.96 12.95,68.58 1.78,68.58 1.78,40.39 6.1,40.39 R17.1
N$34
  Top 0.254: R16.2 3.56,36.83 5.32,36.83 U$1.P15
N$35
  Top 0.254: R8.1 84.77,36.51 85.34,37.08 87.92,37.08 U$11.P$1
N$36  (via drill 0.6)
  Top 0.254: IC1.5 42.67,21.56 42.67,24.13 43.69,25.15 v43.69,34.8 | v48.51,44.7 48.01,44.7 48.01,70.36 50.29,70.36 50.29,75.44 52.32,75.44 52.32,70.36 64.52,70.36 64.52,71.37 95.17,71.37 T1.2
  Bottom 0.254: v43.69,34.8 48.51,34.8 v48.51,44.7
N$37  (via drill 0.6)
  Top 0.254: IC1.20 33.27,21.56 33.27,21.84 29.97,21.84 v29.97,20.83 | v60.45,22.1 61.72,22.1 61.72,19.81 74.93,19.81 R20.1
  Bottom 0.254: v29.97,20.83 29.97,21.84 33.27,21.84 33.27,21.34 57.66,21.34 57.66,22.1 v60.45,22.1
N$38
  Top 0.254: U$12.P$3 41.15,44.69 41.15,37.59 46.23,37.59 46.23,22.35 IC1.6
N$39
  Top 0.254: IC1.7 44.45,23.16 44.45,23.11 45.47,23.11 45.47,36.83 40.39,36.83 40.39,42.93 38.43,42.93 U$12.P$4
N$40
  Top 0.254: IC1.8 44.7,23.96 44.7,35.81 39.62,35.81 39.62,41.91 35.89,41.91 U$12.P$5
N$41
  Top 0.254: IC1.9 42.42,25.45 42.42,35.05 38.86,35.05 38.86,40.89 33.35,40.89 U$12.P$6
N$42
  Top 0.254: IC1.10 41.66,25.45 41.66,34.29 38.1,34.29 38.1,40.13 30.81,40.13 U$12.P$7
N$43
  Top 0.254: IC1.11 40.89,25.45 40.89,33.53 37.34,33.53 37.34,39.37 28.27,39.37 U$12.P$8
N$44
  Top 0.254: IC1.12 40.13,25.45 40.13,32.51 36.58,32.51 36.58,38.61 25.73,38.61 U$12.P$9
N$45
  Top 0.254: IC1.13 39.37,25.45 39.37,31.75 35.81,31.75 35.81,37.85 23.37,37.85 R22.1
N$46
  Top 0.254: JP4.5 27.94,32.38 27.94,24.89 35.94,24.89 37.08,23.88 39.37,18.29 36.76,18.36 IC1.24 35.39,18.03 33.27,18.03 33.27,16.76 R23.2
N$47  (via drill 0.6)
  Top 0.254: IC1.21 32,20.76 v32,20.83 | v60.45,20.83 60.45,15.75 65.41,15.75 65.41,10.54 74.68,10.54 74.68,12.13 R21.1
  Bottom 0.254: v32,20.83 v60.45,20.83
N$48  (via drill 0.6)
  Top 0.254: 37.59,16.87 IC1.26 37.68,15.75 36.07,15.75 36.07,15.49 v34.54,15.49 | v62.99,20.83 62.99,32.26 89.41,32.26 R9.2 | R9.2 87.22,33.09 C28.2 | U$11.P$2 95.21,33.06 95.25,33.02 89.47,33.02 R9.2
  Bottom 0.254: v34.54,15.49 62.99,15.49 v62.99,20.83
N$49
  Top 0.406: R18.1 C16.1
N$50
  Top 0.406: U$3.5 61.72,51.54 61.72,49.02 62.55,49.02 R18.2
N$51
  Top 0.61: U$3.6 63.12,53.85 65.79,53.85 65.79,51.54 U$3.8 65.66,52.88 C17.+ 69.12,54.86 80.01,54.86 80.01,66.8 83.57,66.8 83.57,70.61 65.53,70.61 65.53,69.34 54.36,69.34 54.36,63.75 53.32,63.75 | 53.32,63.75 U$4.P$2 | 53.32,63.75 U$5.P$2 U$6.P$2
N$52  (via drill 0.6)
  Top 0.254: v49.53,48.26 49.53,66.04 U$5.P$1
  Bottom 0.254: JP4.2 39.62,31.19 39.62,48.26 v49.53,48.26
N$53
  Top 0.254: U$8.P$1 77.72,27.72 77.72,28.19 84.07,28.19 84.07,18.29 86.85,18.29 K1.P1
N$54
  Top 0.61: 63.75,59.44 64.01,59.44 64.39,59.05 U$3.2
  Top 0.813: U$7.P$2 61.72,62.75 61.72,60.71 C24.1 62.99,60.71 62.99,59.44 63.75,59.44
N$55
  Top 0.254: R22.2 23.19,41.34 U$12.P$10
N$56
  Top 0.254: U$2.P$1 65.66,60.42 U$3.1
  Top 1.27: 64.73,60.82 C24.2 65.02,60.2 | 65.02,60.2 D1.C | 65.02,60.2 65.66,60.2 U$3.1
N$57  (via drill 0.6)  (1 unrouted)
  Top 0.254: X2.1 26.92,8.42 | C25.1 41.68,14.19 | v51.31,61.21 51.07,61.21 U$4.P$1 | IC1.31 41.66,16.87 41.66,14.22 43.43,14.22 43.56,10.79 v42.55,10.79 | 23.37,14.41 JP1.2
  Top 0.61: 23.37,14.41 23.37,11.18 v25.65,11.18 26.42,11.18 26.42,9.65 26.99,9.65 X2.1
  Bottom 0.254: v51.31,61.21 51.31,60.96 49.53,60.96 49.53,74.42 9.65,74.42 9.65,70.1 1.78,70.1 1.78,31.56 10.16,31.56 10.16,19.3 21.08,19.3 21.08,12.95 25.65,12.95 v25.65,11.18 42.16,11.18 42.16,10.79 v42.55,10.79
N$58  (via drill 0.6)
  Top 0.254: K1.S1 97.01,16.13 81.28,16.13 v81.28,22.61
  Bottom 0.254: v81.28,22.61 68.5,22.61 U$8.P$2
N$59
  Top 0.254: U$8.P$3 68.58,17.56 68.58,16.26 80.01,16.26 80.01,15.62 86.83,15.62 K2.P2
N$60
  Top 0.254: K2.S2 97.03,12.92 97.03,10.67 82.93,10.67 82.93,15.11 79.5,15.11 79.5,15.75 68.71,15.75 68.71,12.48 U$8.P$4
N$61
  Top 0.254: L3.2 R19.1
N$62
  Top 0.254: R19.2 99.31,30.23 99.31,5.33 96.99,5.33 K2.S1
N$63  (via drill 3.2)
  other vias: 32,65.28
N$64  (via drill 3.2)
  other vias: 68.58,38.1
N$65
  Top 0.813: D6.1 76.71,12.45 79.21,12.45 K2.16 79.21,14.03 R21.2
N$66
  Top 0.254: R20.2 D9.1
  Top 0.813: K1.16 76.58,25.95 D9.1
N$67  (via drill 3.2)
  other vias: 73.66,38.1
N$68  (via drill 3.2)
  other vias: 78.74,38.1
N$69  (via drill 3.2)
  other vias: 78.74,43.18
N$70  (via drill 3.2)
  other vias: 73.66,43.18
N$71  (via drill 3.2)
  other vias: 68.58,43.18
N$72  (via drill 2.2)
  other vias: 68.58,40.64
N$73  (via drill 2.2)
  other vias: 71.12,38.1
N$74  (via drill 2.2)
  other vias: 76.2,38.1
N$75  (via drill 2.2)
  other vias: 78.74,40.64
N$76  (via drill 2.2)
  other vias: 76.2,43.18
N$77  (via drill 2.2)
  other vias: 71.12,43.18
N$78
  Top 0.254: 35.81,56.39 35.81,55.12 37.85,55.12 37.85,56.9 35.31,56.9 35.31,54.61 38.35,54.61 38.35,57.4 34.8,57.4 34.8,54.1 38.86,54.1 38.86,57.91 34.29,57.91 34.29,53.59 39.37,53.59 39.37,58.42 33.78,58.42 33.78,53.09 39.88,53.09 39.88,58.93 33.27,58.93 33.27,52.58 40.39,52.58 40.39,59.44 32.77,59.44 32.77,52.07 40.89,52.07 40.89,59.94 32.26,59.94 32.26,51.56 41.4,51.56 41.4,60.45 31.75,60.45 31.75,51.05 41.91,51.05 41.91,60.96 31.24,60.96 31.24,50.55 42.42,50.55 42.42,61.47 34.16,61.47 34.16,61.85 33.27,61.85
N$79
  Top 0.254: 0.13,0.13 101.47,0.13 101.47,76.07 0.13,76.07 0.13,0.13
N$80  (via drill 0.6)
  Top 0.254: 35.94,56.39 36.07,56.39 36.45,56.01 v36.96,56.01
N$81  (via drill 0.6)
  other vias: 33.27,61.85
N$82
  Bottom 0.254: 0.13,0.13 101.47,0.13 101.47,76.07 0.13,76.07 0.13,0.13
S$1
  Top 0.254: 41.66,19.3 40.89,20.07 | 41.66,19.3 41.66,19.81 | 41.15,19.3 41.66,19.3
S$2
  Top 0.254: 10.92,67.31 12.19,67.31 | 10.92,67.31 11.18,67.06 | 11.18,67.56 10.92,67.31
VCC  (via drill 0.6, 0.8)
  Top 0.254: U$12.P$2 43.43,44.69 43.43,44.45 | K2.P1 86.87,5.3 86.87,7.37 98.81,7.37 98.81,28.7 88.39,28.7 88.39,25.91 86.85,25.91 K1.P2 | v84.33,33.15 R8.2 | T1.3 93.4,70.61 86.61,70.61 86.61,68.83 R6.2 85.92,68.58 v85.09,68.58 | R4.2 87.88,48.01 v88.9,48.01 | v84.33,39.37 v84.33,48.01 | v82.04,68.58 78.99,68.37 72.87,68.37 U$2.P$2 67.3,65.57 67.3,64.78 61.47,64.78 U$7.P$1 59.86,64.75 C10.2 | R23.1 27.18,16.76 v27.18,17.27 | v40.39,18.54 42.48,18.54
  Top 0.61: C7.2 16.6,50.99 IC2.15 17.53,50.99 17.53,51.05 15.24,51.05 15.24,56.07 IC2.19 | C6.2 17.63,56.48 IC2.19 | IC2.19 IC2.20 15.24,57.34 15.24,63.69 IC2.25 19.56,63.69 19.56,67.56 19.3,67.56 17.78,67.56 17.78,67.5 IC2.28 | C15.1 44.36,16.87 IC1.32 42.48,18.54 42.48,20.76 IC1.4 45.76,20.76 C14.2
  Top 0.813: 43.43,44.69 43.43,74.3 17.63,74.3 17.63,69.51 | 43.43,44.45 43.43,40.39 58.42,40.39 | 58.42,40.39 58.67,40.39 58.67,6.35 46.23,6.35 | C15.1 44.36,12.45 46.23,12.45 46.23,6.35 | U$3.3 U$3.4 60.71,57.68 60.71,59.05 C23.2 | C23.2 58.89,56.77 C22.2 C21.2 C20.2 58.76,50.04 C18.2 58.63,47.75 | 58.63,47.75 C19.2 | 58.63,47.75 58.42,47.75 58.42,40.39 | 17.63,69.51 C11.1 | 17.63,69.51 IC2.28 | C23.2 58.89,60.96 58.17,60.96 58.17,64.75 U$7.P$1 | 19.3,67.56 C5.1 | C29.+ 46.23,5.47 46.23,6.35
  Bottom 0.254: K1.P2 84.33,28.47 v84.33,33.15 v84.33,39.37 | T1.3 98.59,64.77 99.31,64.77 99.31,48.01 v88.9,48.01 v84.33,48.01 | v85.09,68.58 v82.04,68.58 | v27.18,17.27 33.27,17.27 33.27,17.78 40.39,17.78 v40.39,18.54
(copper drawn outside any net)
  shapes: Top area x23

### Text on the board
Top: Bear@Yikes.com | Happy Bday RWS | Rev. 0 | 10.10 | 2011 | H+ | C- | GND | Design | by | Charles | Shiflett
tDocu: 1. | 3. | H+ | H- | H | C+ | C- | +5V | USB | C | GND | 2.